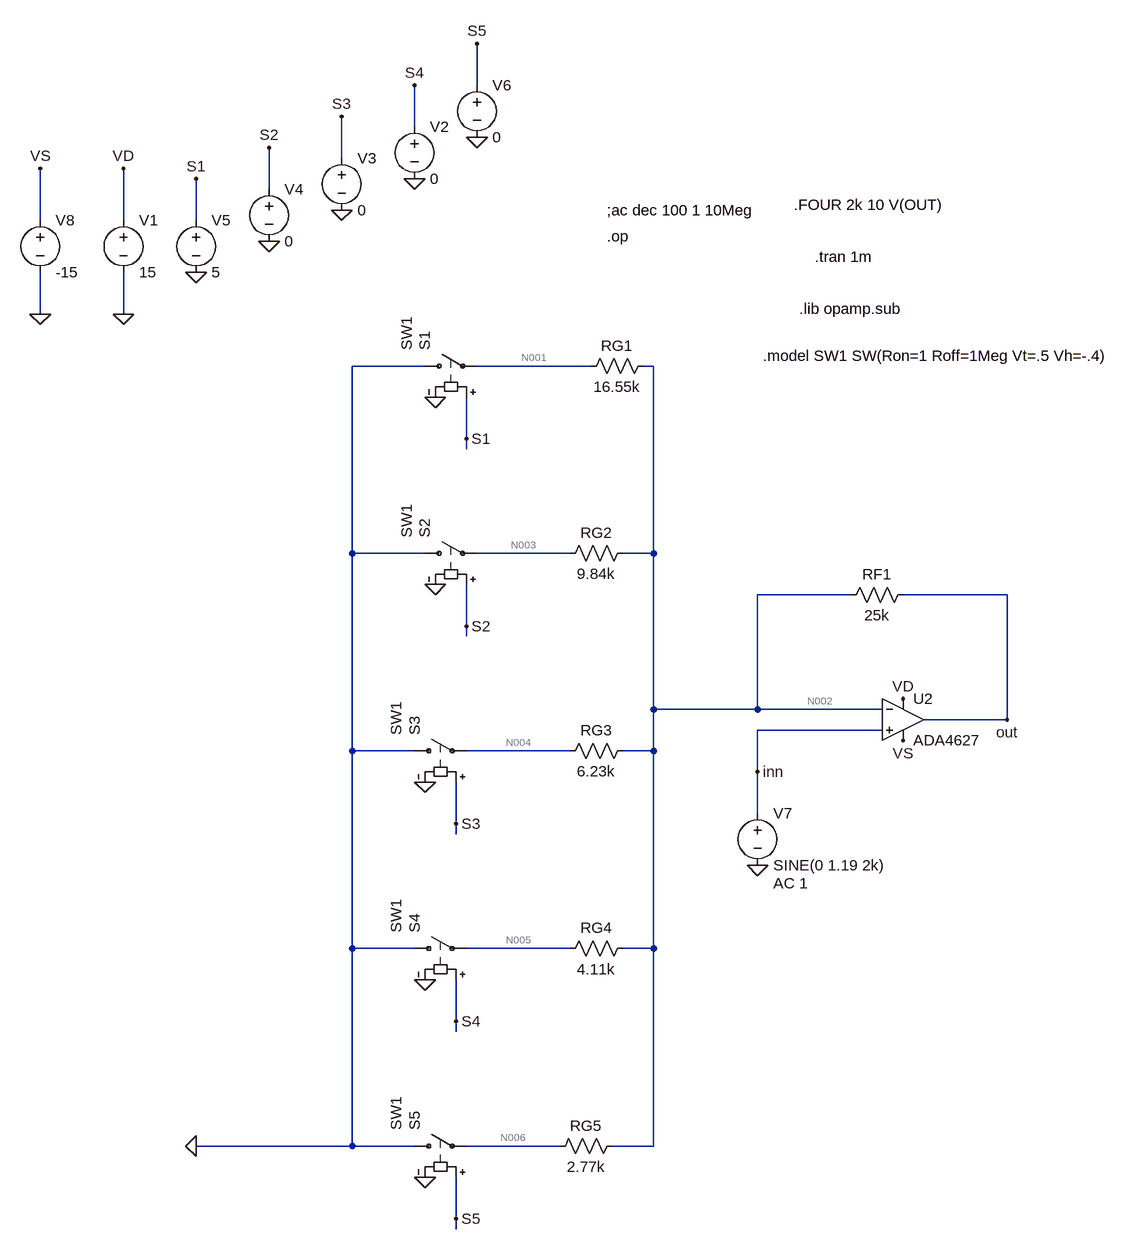
[diagram p0: schematic Etaj 3.asc]
Etaj 3.asc, the LTspice schematic file:
Version 4
SHEET 1 1720 1244
WIRE -64 -640 -64 -704
WIRE -160 -576 -160 -640
WIRE -272 -528 -272 -592
WIRE -384 -480 -384 -544
WIRE -736 -432 -736 -512
WIRE -608 -432 -608 -512
WIRE -496 -432 -496 -496
WIRE -736 -288 -736 -352
WIRE -608 -288 -608 -352
WIRE -144 -208 -256 -208
WIRE 112 -208 -64 -208
WIRE 208 -208 192 -208
WIRE -80 -96 -80 -160
WIRE -80 -80 -80 -96
WIRE -256 80 -256 -208
WIRE -144 80 -256 80
WIRE 80 80 -64 80
WIRE 208 80 208 -208
WIRE 208 80 160 80
WIRE 512 144 368 144
WIRE 752 144 592 144
WIRE -80 192 -80 128
WIRE -80 208 -80 192
WIRE 208 320 208 80
WIRE 368 320 368 144
WIRE 368 320 208 320
WIRE 560 320 368 320
WIRE 752 336 752 144
WIRE 752 336 624 336
WIRE 560 352 368 352
WIRE -256 384 -256 80
WIRE -160 384 -256 384
WIRE 80 384 -80 384
WIRE 208 384 208 320
WIRE 208 384 160 384
WIRE 368 416 368 352
WIRE 368 480 368 416
WIRE -96 496 -96 432
WIRE -96 512 -96 496
WIRE -256 688 -256 384
WIRE -160 688 -256 688
WIRE 80 688 -80 688
WIRE 208 688 208 384
WIRE 208 688 160 688
WIRE -96 800 -96 736
WIRE -96 816 -96 800
WIRE -256 992 -256 688
WIRE -256 992 -496 992
WIRE -160 992 -256 992
WIRE 64 992 -80 992
WIRE 208 992 208 688
WIRE 208 992 144 992
WIRE -96 1104 -96 1040
WIRE -96 1120 -96 1104
FLAG -608 -288 0
FLAG -608 -512 VD
FLAG -496 -352 0
FLAG -384 -400 0
FLAG -272 -448 0
FLAG -160 -496 0
FLAG -496 -496 S1
FLAG -384 -544 S2
FLAG -272 -592 S3
FLAG -160 -640 S4
FLAG -64 -560 0
FLAG -64 -704 S5
FLAG 368 560 0
FLAG 752 336 out
FLAG 592 304 VD
FLAG 592 368 VS
FLAG 368 416 inn
FLAG -496 992 0
FLAG -128 -160 0
FLAG -80 -96 S1
FLAG -128 128 0
FLAG -80 192 S2
FLAG -144 432 0
FLAG -96 496 S3
FLAG -144 736 0
FLAG -96 800 S4
FLAG -144 1040 0
FLAG -96 1104 S5
FLAG -736 -288 0
FLAG -736 -512 VS
DATAFLAG -496 -464 ""
DATAFLAG -384 -512 ""
DATAFLAG -272 -560 ""
DATAFLAG -160 -608 ""
DATAFLAG -64 -672 ""
SYMBOL res 208 -224 R90
WINDOW 0 0 56 VBottom 2
WINDOW 3 32 56 VTop 2
SYMATTR InstName RG1
SYMATTR Value 16.55k
SYMBOL res 176 64 R90
WINDOW 0 0 56 VBottom 2
WINDOW 3 32 56 VTop 2
SYMATTR InstName RG2
SYMATTR Value 9.84k
SYMBOL res 176 368 R90
WINDOW 0 0 56 VBottom 2
WINDOW 3 32 56 VTop 2
SYMATTR InstName RG3
SYMATTR Value 6.23k
SYMBOL res 176 672 R90
WINDOW 0 0 56 VBottom 2
WINDOW 3 32 56 VTop 2
SYMATTR InstName RG4
SYMATTR Value 4.11k
SYMBOL voltage -608 -448 R0
WINDOW 123 0 0 Left 2
WINDOW 39 0 0 Left 2
SYMATTR InstName V1
SYMATTR Value 15
SYMBOL voltage -160 -592 R0
WINDOW 123 0 0 Left 0
WINDOW 39 0 0 Left 0
SYMATTR InstName V2
SYMATTR Value 0
SYMBOL voltage -272 -544 R0
WINDOW 123 0 0 Left 0
WINDOW 39 0 0 Left 0
SYMATTR InstName V3
SYMATTR Value 0
SYMBOL voltage -384 -496 R0
WINDOW 123 0 0 Left 0
WINDOW 39 0 0 Left 0
SYMATTR InstName V4
SYMATTR Value 0
SYMBOL voltage -496 -448 R0
WINDOW 123 0 0 Left 0
WINDOW 39 0 0 Left 0
SYMATTR InstName V5
SYMATTR Value 5
SYMBOL voltage -64 -656 R0
WINDOW 123 0 0 Left 0
WINDOW 39 0 0 Left 0
SYMATTR InstName V6
SYMATTR Value 0
SYMBOL res 608 128 R90
WINDOW 0 0 56 VBottom 2
WINDOW 3 32 56 VTop 2
SYMATTR InstName RF1
SYMATTR Value 25k
SYMBOL res 160 976 R90
WINDOW 0 0 56 VBottom 2
WINDOW 3 32 56 VTop 2
SYMATTR InstName RG5
SYMATTR Value 2.77k
SYMBOL voltage 368 464 R0
WINDOW 123 24 124 Left 2
WINDOW 39 0 0 Left 0
SYMATTR Value2 AC 1
SYMATTR InstName V7
SYMATTR Value SINE(0 1.19 2k)
SYMBOL sw -160 -208 R270
WINDOW 3 24 -12 Left 2
SYMATTR Value SW1
SYMATTR InstName S1
SYMBOL sw -160 80 R270
WINDOW 3 24 -12 Left 2
SYMATTR Value SW1
SYMATTR InstName S2
SYMBOL sw -176 384 R270
WINDOW 3 24 -12 Left 2
SYMATTR Value SW1
SYMATTR InstName S3
SYMBOL sw -176 688 R270
WINDOW 3 24 -12 Left 2
SYMATTR Value SW1
SYMATTR InstName S4
SYMBOL sw -176 992 R270
WINDOW 3 24 -12 Left 2
SYMATTR Value SW1
SYMATTR InstName S5
SYMBOL voltage -736 -448 R0
WINDOW 123 0 0 Left 2
WINDOW 39 0 0 Left 2
SYMATTR InstName V8
SYMATTR Value -15
SYMBOL OpAmps\\ADA4627 592 272 R0
SYMATTR InstName U2
TEXT 136 -448 Left 2 !;ac dec 100 1 10Meg
TEXT 136 -408 Left 2 !.op
TEXT 424 -456 Left 2 !.FOUR 2k 10 V(OUT)
TEXT 456 -376 Left 2 !.tran 1m
TEXT 432 -296 Left 2 !.lib opamp.sub
TEXT 376 -224 Left 2 !.model SW1 SW(Ron=1 Roff=1Meg Vt=.5 Vh=-.4)

The netlist it stands for:
* Etaj 3.asc
RG1 N002 N001 16.55k
RG2 N002 N003 9.84k
RG3 N002 N004 6.23k
RG4 N002 N005 4.11k
V1 VD 0 15
V2 S4 0 0
V3 S3 0 0
V4 S2 0 0
V5 S1 0 5
V6 S5 0 0
RF1 out N002 25k
RG5 N002 N006 2.77k
V7 inn 0 SINE(0 1.19 2k) AC 1
S1 0 N001 S1 0 SW1
S2 0 N003 S2 0 SW1
S3 0 N004 S3 0 SW1
S4 0 N005 S4 0 SW1
S5 0 N006 S5 0 SW1
V8 VS 0 -15
XU2 inn N002 VD VS out ADA4627  ; pins In+ In- V+ V- OUT
;ac dec 100 1 10Meg
.op
.FOUR 2k 10 V(OUT)
.tran 1m
.lib opamp.sub
.model SW1 SW(Ron=1 Roff=1Meg Vt=.5 Vh=-.4)
.backanno
.end

* Results of the author's LTspice run, read from the files saved beside the schematic
* Operating Point, zero values left out:
*   V(n002) = -292.3 µV
*   V(n001) = -17.66 nV
*   V(n003) = -289.5 µV
*   V(n004) = -290.5 µV
*   V(n005) = -291.1 µV
*   V(vd) = 15 V
*   V(s1) = 5 V
*   V(out) = -763.3 µV
*   V(n006) = -291.5 µV
*   V(vs) = -15 V
*   I(Rg1) = -17.66 nA
*   I(Rg2) = -289.5 pA
*   I(Rg3) = -290.5 pA
*   I(Rg4) = -291.1 pA
*   I(Rf1) = -18.84 nA
*   I(Rg5) = -291.5 pA
*   I(S1) = -17.66 nA
*   I(S2) = -289.5 pA
*   I(S3) = -290.5 pA
*   I(S4) = -291.1 pA
*   I(S5) = -291.5 pA
*   I(V1) = -6.899 mA
*   I(V7) = 15.02 pA
*   I(V8) = 6.899 mA
*   Ix(u2:1) = -15.02 pA
*   Ix(u2:2) = -15.52 pA
*   Ix(u2:99) = 6.899 mA
*   Ix(u2:50) = -6.899 mA
*   Ix(u2:30) = 18.84 nA
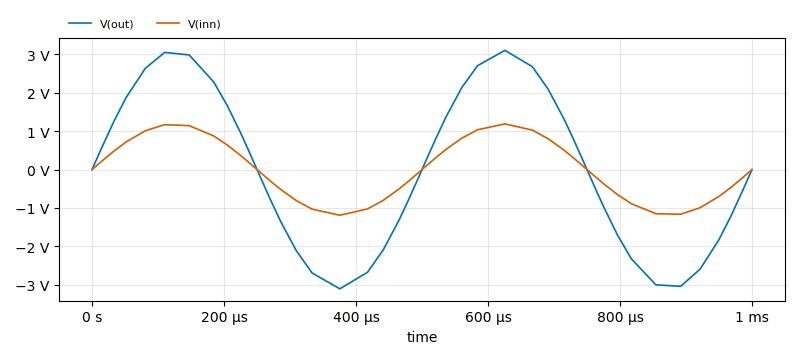
[diagram p1: Transient Analysis of Etaj 3.asc, plotted from the saved traces]
* Transient Analysis, 1 run:
*   V(out): min -3.105 V, max 3.103 V, average -648.4 µV, rms 2.174 V, last 1.39 mV
*   V(inn): min -1.189 V, max 1.189 V, average 43.94 µV, rms 833.1 mV, last 0 V
* From the log:
*   N-Period=1
*   Fourier components of V(out)
*   DC component:-0.000731361
*   Harmonic  Frequency   Fourier   Normalized   Phase    Normalized
*    Number     [Hz]     Component   Component  [degree]  Phase [deg]
*       1      2.000e+3   3.106e+0   1.000e+0     89.96°      0.00°
*       2      4.000e+3   4.117e-4   1.326e-4   -134.28°   -224.24°
*       3      6.000e+3   1.174e-3   3.780e-4    111.67°     21.72°
*       4      8.000e+3   1.100e-3   3.543e-4     36.21°    -53.75°
*       5      1.000e+4   7.226e-4   2.327e-4    -28.84°   -118.80°
*       6      1.200e+4   1.190e-3   3.832e-4   -146.08°   -236.04°
*       7      1.400e+4   3.929e-4   1.265e-4    127.38°     37.42°
*       8      1.600e+4   4.243e-4   1.366e-4   -139.13°   -229.09°
*       9      1.800e+4   1.096e-3   3.530e-4   -141.25°   -231.21°
*      10      2.000e+4   1.849e-3   5.955e-4     42.41°    -47.55°
*   Partial Harmonic Distortion: 0.100046%
*   Total Harmonic Distortion:   0.110300%